# Altium schematic sheet 2022_AESK_UAV_EXT_CONN.SchDoc: =ProjectNAME
size A4; Author: Fatih; Organization: AESK; Address1: Designed by:; Address3: FATİH CAN; SheetNumber: 4; SheetTotal: 6
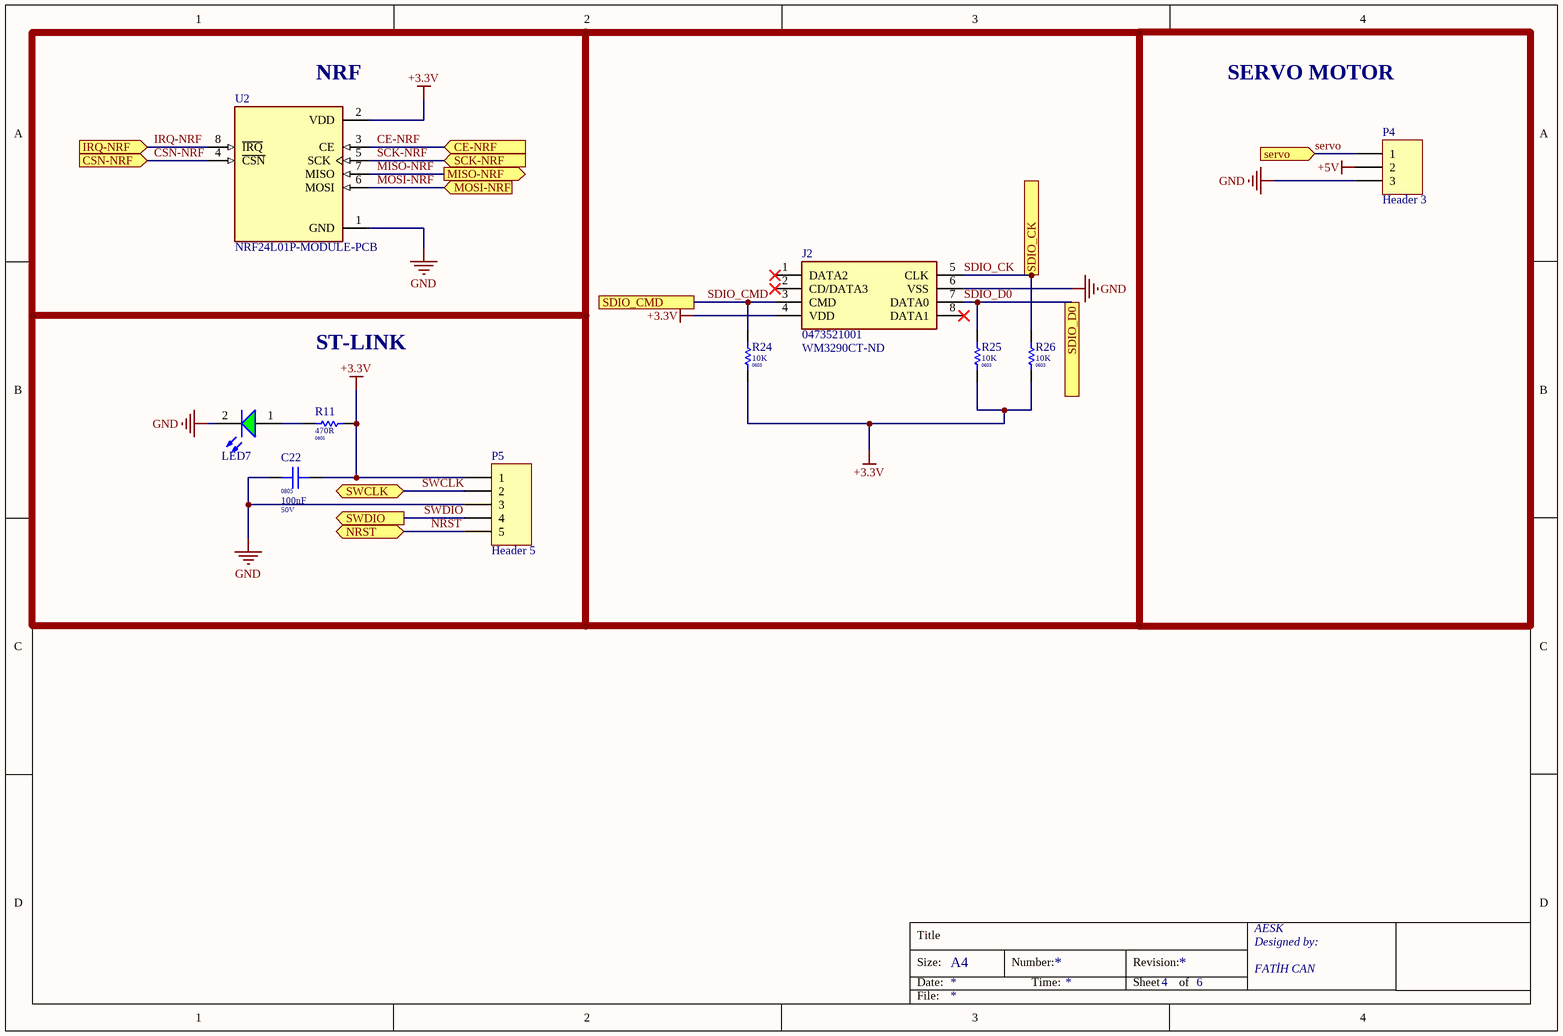
[diagram p0: 2022_AESK_UAV_EXT_CONN.SchDoc]

## Parts
C22  Package / Case: 0805  Voltage: 50V  [CAPC 0805]  (hidden comment: 100nF)
J2  0473521001  Supplier Part Number 1: WM3290CT-ND  [47352-1001]
LED7  (no value)  [LED GREEN 0805]
P4  Header 3  [HDR1X3]
P5  Header 5  [HDR1X5]
R11  Package / Case: 0805  [RESC 0805]  (hidden comment: 470R)
R24  Package / Case: 0603  [RESC 0603]  (hidden comment: 10K)
R25  Package / Case: 0603  [RESC 0603]  (hidden comment: 10K)
R26  Package / Case: 0603  [RESC 0603]  (hidden comment: 10K)
U2  NRF24L01P-MODULE-PCB  [nrf]

## Ports
CE-NRF (in), CSN-NRF (in), IRQ-NRF (in), MISO-NRF (out), MOSI-NRF (in), NRST (bidir), SCK-NRF (in), SDIO_CK, SDIO_CMD, SDIO_D0, servo (in), SWCLK (bidir), SWDIO (out)

## Nets
+3.3V: C22.2 J2.4(VDD) P5.1 R11.2 R24.1 R25.1 R26.1 U2.2(VDD)
+5V: P4.2
GND: C22.1 J2.6(VSS) LED7.2(C) P4.3 P5.3 U2.1(GND)
CE-NRF: U2.3(CE) ; port CE-NRF
CSN-NRF: U2.4(~{CSN}) ; port CSN-NRF
IRQ-NRF: U2.8(~{IRQ}) ; port IRQ-NRF
MISO-NRF: U2.7(MISO) ; port MISO-NRF
MOSI-NRF: U2.6(MOSI) ; port MOSI-NRF
NRST: P5.5 ; port NRST
SCK-NRF: U2.5(SCK) ; port SCK-NRF
SDIO_CK: J2.5(CLK) R26.2 ; port SDIO_CK
SDIO_CMD: J2.3(CMD) R24.2 ; port SDIO_CMD
SDIO_D0: J2.7(DATA0) R25.2 ; port SDIO_D0
servo: P4.1 ; port servo
SWCLK: P5.2 ; port SWCLK
SWDIO: P5.4 ; port SWDIO
NetLED7_1: LED7.1(A) R11.1

Not connected (* = marked no-connect by the designer): J2 1(DATA2)* 2(CD/DATA3)* 8(DATA1)*

## Notes on the sheet
- (near U2) NRF
- SERVO MOTOR
- ST-LINK
- Title
- Size:
- Date:
- A4
- Number:
- Time:
- Revision:
- Sheet
- of
- File:

## Library data of the parts
C22 = CAPC0572: Capacitor Ceramic 100nF 50V 0805; Tolerance: %10; Value Rating: nF; Favorites: Favorite; Value: 100nF; Part Number: CAPC0572; Category: Capacitor Ceramic; Values: 100nF 50V
J2 = 0473521001: microSD Card Module; Manufacturer_Name: Molex; Datasheet Link: https://www.molex.com/pdm_docs/sd/473521001_sd.pdf; Manufacturer_Part_Number: 0473521001; Supplier 1: Digi-Key
LED7 = LED GREEN: LED
P4 = Header 3: Header, 3-Pin; LatestRevisionDate: 17-Jul-2002; LatestRevisionNote: Re-released for DXP Platform.; Publisher: Altium Limited
P5 = Header 5: Header, 5-Pin; LatestRevisionDate: 17-Jul-2002; LatestRevisionNote: Re-released for DXP Platform.; Publisher: Altium Limited
R11 = R0334: 470R 0805; Part Number: R0334; Tolerance: %5; Power: 1/10W; Value: 470R; Category: Resistor; Values: 470R
R24-R26 = R0220: 10K 0603; Part Number: R0220; Tolerance: %5; Power: 1/10W; Value: 10K; Category: Resistor; Values: 10K
U2 = NRF24L01P-MODULE-PCB: - Transceiver For Use With nRF24L01+; MF: Nordic Semiconductor; Package: None; MP: NRF24L01P-MODULE-PCB; Value: *; Availability: Bad; Price: None; SnapEDA_Link: https://www.snapeda.com/parts/NRF24L01P-MODULE-PCB/Nordic%20Semiconductor%20ASA/view-part/230534/?ref=snap; Mouser-Purchase-URL: https://snapeda.com/shop?store=Mouser&id=230534